# EAGLE design tongueboard (EAGLE 6.4)
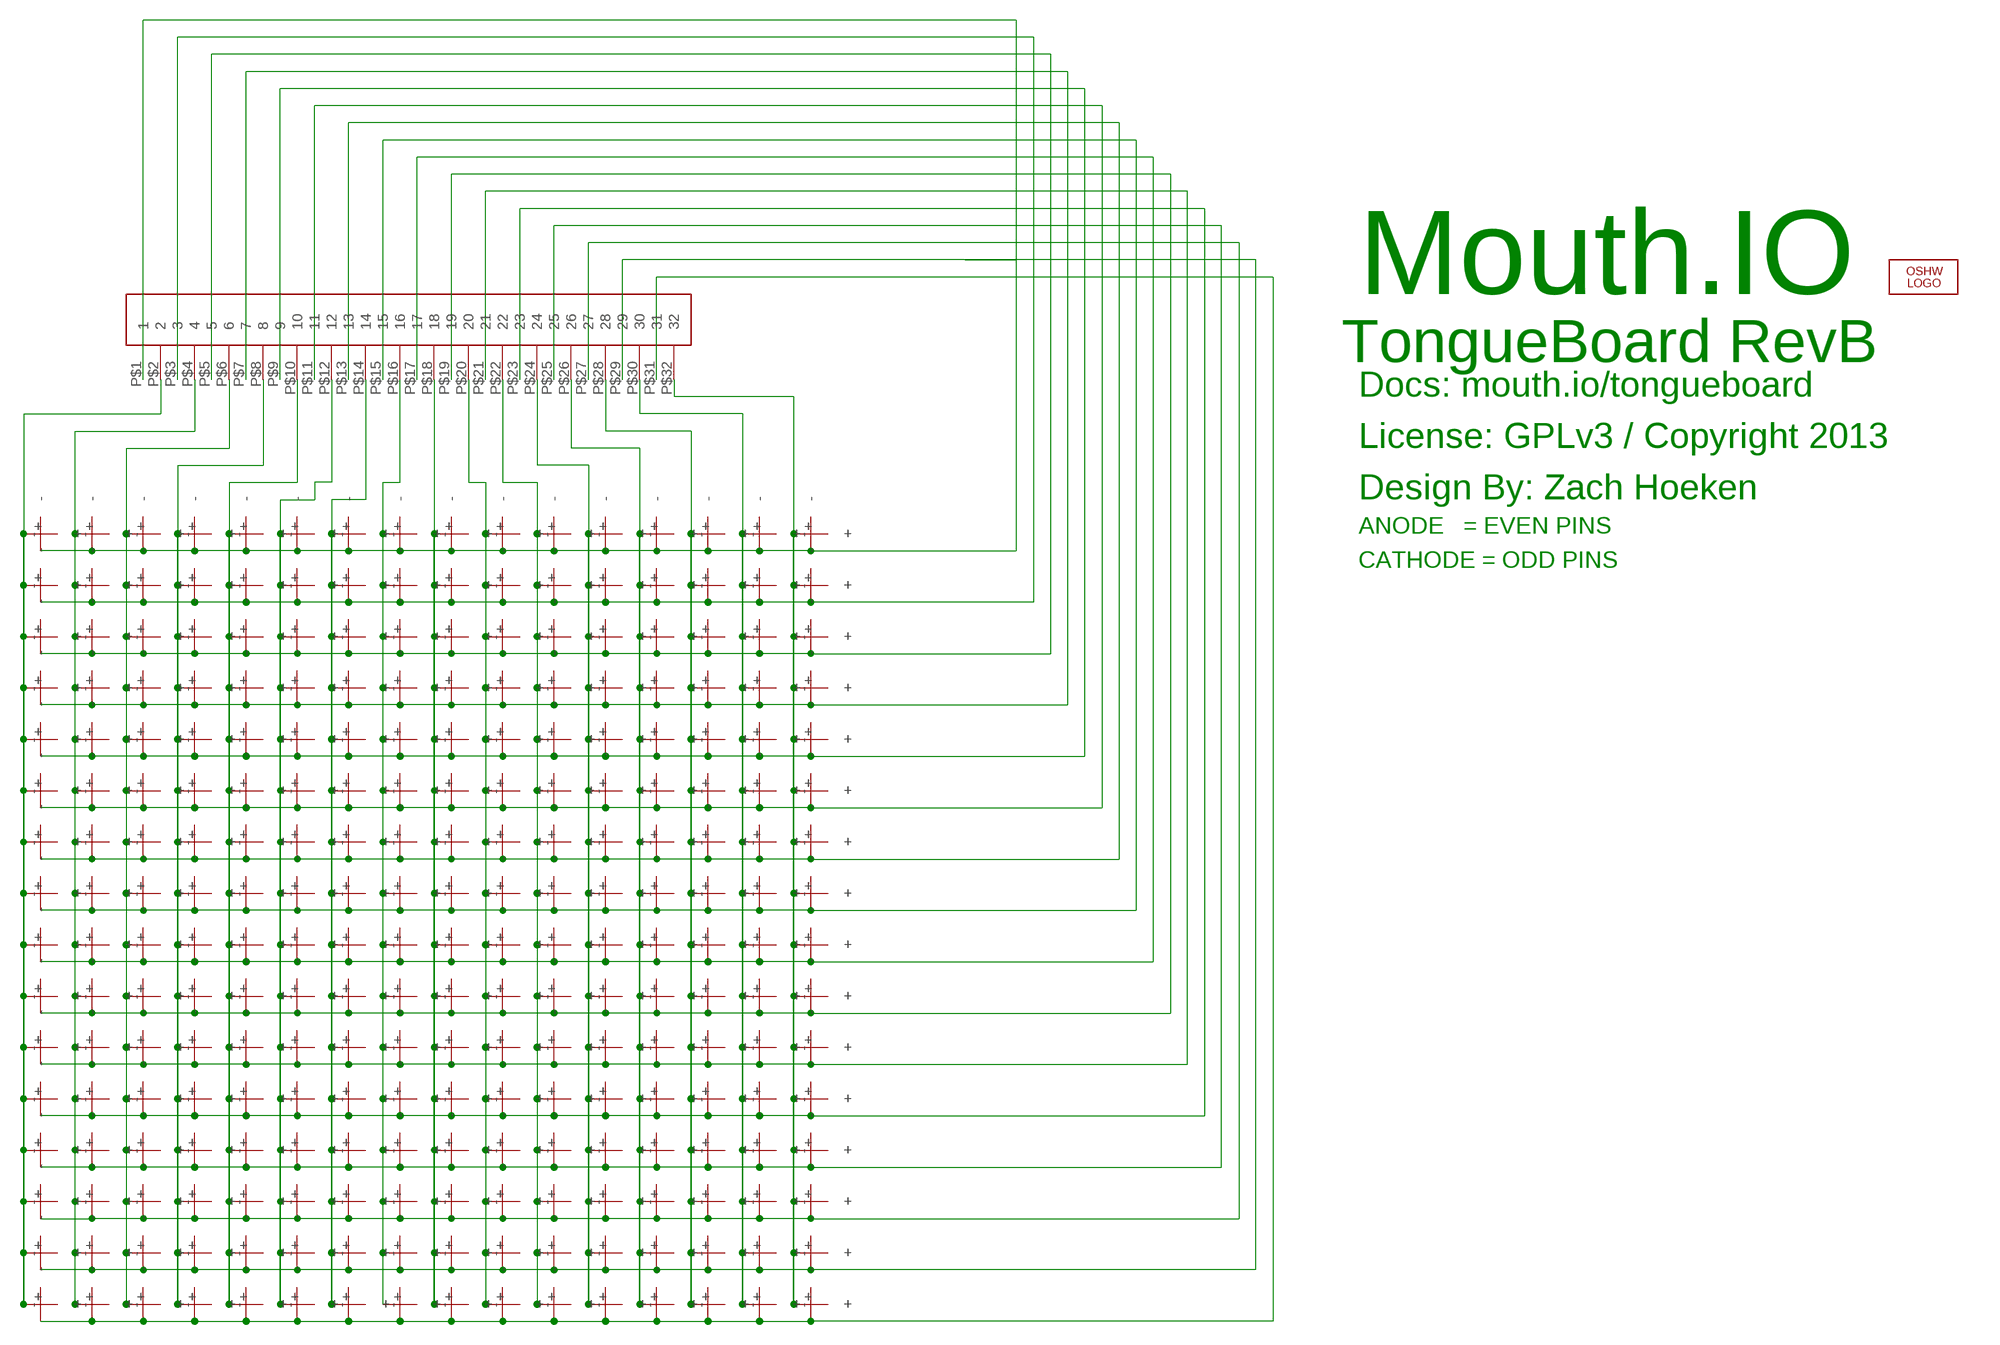
[diagram p0: schematic, sheet 1]

## Parts
LOGO1  OSHW_LOGO_10MIL  [OSHW_10X500_NOTEXT_COPPER]
U$1  ELECTRODE60MIL  [61MIL]
U$2  ELECTRODE60MIL  [61MIL]
U$3  ELECTRODE60MIL  [61MIL]
U$4  ELECTRODE60MIL  [61MIL]
U$5  ELECTRODE60MIL  [61MIL]
U$6  ELECTRODE60MIL  [61MIL]
U$7  ELECTRODE60MIL  [61MIL]
U$8  ELECTRODE60MIL  [61MIL]
U$9  ELECTRODE60MIL  [61MIL]
U$10  ELECTRODE60MIL  [61MIL]
U$11  ELECTRODE60MIL  [61MIL]
U$12  ELECTRODE60MIL  [61MIL]
U$13  ELECTRODE60MIL  [61MIL]
U$14  ELECTRODE60MIL  [61MIL]
U$15  ELECTRODE60MIL  [61MIL]
U$16  ELECTRODE61MILJCT  [61MILJCT]
U$17  ELECTRODE60MIL  [61MIL]
U$18  ELECTRODE60MIL  [61MIL]
U$19  ELECTRODE60MIL  [61MIL]
U$20  ELECTRODE60MIL  [61MIL]
U$21  ELECTRODE60MIL  [61MIL]
U$22  ELECTRODE60MIL  [61MIL]
U$23  ELECTRODE60MIL  [61MIL]
U$24  ELECTRODE60MIL  [61MIL]
U$25  ELECTRODE60MIL  [61MIL]
U$26  ELECTRODE60MIL  [61MIL]
U$27  ELECTRODE60MIL  [61MIL]
U$28  ELECTRODE60MIL  [61MIL]
U$29  ELECTRODE60MIL  [61MIL]
U$30  ELECTRODE60MIL  [61MIL]
U$31  ELECTRODE61MILJCT  [61MILJCT]
U$32  ELECTRODE60MIL  [61MIL]
U$33  ELECTRODE60MIL  [61MIL]
U$34  ELECTRODE60MIL  [61MIL]
U$35  ELECTRODE60MIL  [61MIL]
U$36  ELECTRODE60MIL  [61MIL]
U$37  ELECTRODE60MIL  [61MIL]
U$38  ELECTRODE60MIL  [61MIL]
U$39  ELECTRODE60MIL  [61MIL]
U$40  ELECTRODE60MIL  [61MIL]
U$41  ELECTRODE60MIL  [61MIL]
U$42  ELECTRODE60MIL  [61MIL]
U$43  ELECTRODE60MIL  [61MIL]
U$44  ELECTRODE60MIL  [61MIL]
U$45  ELECTRODE60MIL  [61MIL]
U$46  ELECTRODE61MILJCT  [61MILJCT]
U$47  ELECTRODE60MIL  [61MIL]
U$48  ELECTRODE60MIL  [61MIL]
U$49  ELECTRODE60MIL  [61MIL]
U$50  ELECTRODE60MIL  [61MIL]
U$51  ELECTRODE60MIL  [61MIL]
U$52  ELECTRODE60MIL  [61MIL]
U$53  ELECTRODE60MIL  [61MIL]
U$54  ELECTRODE60MIL  [61MIL]
U$55  ELECTRODE60MIL  [61MIL]
U$56  ELECTRODE60MIL  [61MIL]
U$57  ELECTRODE60MIL  [61MIL]
U$58  ELECTRODE60MIL  [61MIL]
U$59  ELECTRODE60MIL  [61MIL]
U$60  ELECTRODE60MIL  [61MIL]
U$61  ELECTRODE61MILJCT  [61MILJCT]
U$62  ELECTRODE60MIL  [61MIL]
U$63  ELECTRODE60MIL  [61MIL]
U$64  ELECTRODE60MIL  [61MIL]
U$65  ELECTRODE60MIL  [61MIL]
U$66  ELECTRODE60MIL  [61MIL]
U$67  ELECTRODE60MIL  [61MIL]
U$68  ELECTRODE60MIL  [61MIL]
U$69  ELECTRODE60MIL  [61MIL]
U$70  ELECTRODE60MIL  [61MIL]
U$71  ELECTRODE60MIL  [61MIL]
U$72  ELECTRODE60MIL  [61MIL]
U$73  ELECTRODE60MIL  [61MIL]
U$74  ELECTRODE60MIL  [61MIL]
U$75  ELECTRODE60MIL  [61MIL]
U$76  ELECTRODE61MILJCT  [61MILJCT]
U$77  ELECTRODE60MIL  [61MIL]
U$78  ELECTRODE60MIL  [61MIL]
U$79  ELECTRODE60MIL  [61MIL]
U$80  ELECTRODE60MIL  [61MIL]
U$81  ELECTRODE60MIL  [61MIL]
U$82  ELECTRODE60MIL  [61MIL]
U$83  ELECTRODE60MIL  [61MIL]
U$84  ELECTRODE60MIL  [61MIL]
U$85  ELECTRODE60MIL  [61MIL]
U$86  ELECTRODE60MIL  [61MIL]
U$87  ELECTRODE60MIL  [61MIL]
U$88  ELECTRODE60MIL  [61MIL]
U$89  ELECTRODE60MIL  [61MIL]
U$90  ELECTRODE60MIL  [61MIL]
U$91  ELECTRODE61MILJCT  [61MILJCT]
U$92  ELECTRODE60MIL  [61MIL]
U$93  ELECTRODE60MIL  [61MIL]
U$94  ELECTRODE60MIL  [61MIL]
U$95  ELECTRODE60MIL  [61MIL]
U$96  ELECTRODE60MIL  [61MIL]
U$97  ELECTRODE60MIL  [61MIL]
U$98  ELECTRODE60MIL  [61MIL]
U$99  ELECTRODE60MIL  [61MIL]
U$100  ELECTRODE60MIL  [61MIL]
U$101  ELECTRODE60MIL  [61MIL]
U$102  ELECTRODE60MIL  [61MIL]
U$103  ELECTRODE60MIL  [61MIL]
U$104  ELECTRODE60MIL  [61MIL]
U$105  ELECTRODE60MIL  [61MIL]
U$106  ELECTRODE61MILJCT  [61MILJCT]
U$107  ELECTRODE60MIL  [61MIL]
U$108  ELECTRODE60MIL  [61MIL]
U$109  ELECTRODE60MIL  [61MIL]
U$110  ELECTRODE60MIL  [61MIL]
U$111  ELECTRODE60MIL  [61MIL]
U$112  ELECTRODE60MIL  [61MIL]
U$113  ELECTRODE60MIL  [61MIL]
U$114  ELECTRODE60MIL  [61MIL]
U$115  ELECTRODE60MIL  [61MIL]
U$116  ELECTRODE60MIL  [61MIL]
U$117  ELECTRODE60MIL  [61MIL]
U$118  ELECTRODE60MIL  [61MIL]
U$119  ELECTRODE60MIL  [61MIL]
U$120  ELECTRODE60MIL  [61MIL]
U$121  ELECTRODE61MILJCT  [61MILJCT]
U$122  ELECTRODE60MIL  [61MIL]
U$123  ELECTRODE60MIL  [61MIL]
U$124  ELECTRODE60MIL  [61MIL]
U$125  ELECTRODE60MIL  [61MIL]
U$126  ELECTRODE60MIL  [61MIL]
U$127  ELECTRODE60MIL  [61MIL]
U$128  ELECTRODE60MIL  [61MIL]
U$129  ELECTRODE60MIL  [61MIL]
U$130  ELECTRODE60MIL  [61MIL]
U$131  ELECTRODE60MIL  [61MIL]
U$132  ELECTRODE60MIL  [61MIL]
U$133  ELECTRODE60MIL  [61MIL]
U$134  ELECTRODE60MIL  [61MIL]
U$135  ELECTRODE60MIL  [61MIL]
U$136  ELECTRODE61MILJCT  [61MILJCT]
U$137  ELECTRODE60MIL  [61MIL]
U$138  ELECTRODE60MIL  [61MIL]
U$139  ELECTRODE60MIL  [61MIL]
U$140  ELECTRODE60MIL  [61MIL]
U$141  ELECTRODE60MIL  [61MIL]
U$142  ELECTRODE60MIL  [61MIL]
U$143  ELECTRODE60MIL  [61MIL]
U$144  ELECTRODE60MIL  [61MIL]
U$145  ELECTRODE60MIL  [61MIL]
U$146  ELECTRODE60MIL  [61MIL]
U$147  ELECTRODE60MIL  [61MIL]
U$148  ELECTRODE60MIL  [61MIL]
U$149  ELECTRODE60MIL  [61MIL]
U$150  ELECTRODE60MIL  [61MIL]
U$151  ELECTRODE61MILJCT  [61MILJCT]
U$152  ELECTRODE60MIL  [61MIL]
U$153  ELECTRODE60MIL  [61MIL]
U$154  ELECTRODE60MIL  [61MIL]
U$155  ELECTRODE60MIL  [61MIL]
U$156  ELECTRODE60MIL  [61MIL]
U$157  ELECTRODE60MIL  [61MIL]
U$158  ELECTRODE60MIL  [61MIL]
U$159  ELECTRODE60MIL  [61MIL]
U$160  ELECTRODE60MIL  [61MIL]
U$161  ELECTRODE60MIL  [61MIL]
U$162  ELECTRODE60MIL  [61MIL]
U$163  ELECTRODE60MIL  [61MIL]
U$164  ELECTRODE60MIL  [61MIL]
U$165  ELECTRODE60MIL  [61MIL]
U$166  ELECTRODE61MILJCT  [61MILJCT]
U$167  ELECTRODE60MIL  [61MIL]
U$168  ELECTRODE60MIL  [61MIL]
U$169  ELECTRODE60MIL  [61MIL]
U$170  ELECTRODE60MIL  [61MIL]
U$171  ELECTRODE60MIL  [61MIL]
U$172  ELECTRODE60MIL  [61MIL]
U$173  ELECTRODE60MIL  [61MIL]
U$174  ELECTRODE60MIL  [61MIL]
U$175  ELECTRODE60MIL  [61MIL]
U$176  ELECTRODE60MIL  [61MIL]
U$177  ELECTRODE60MIL  [61MIL]
U$178  ELECTRODE60MIL  [61MIL]
U$179  ELECTRODE60MIL  [61MIL]
U$180  ELECTRODE60MIL  [61MIL]
U$181  ELECTRODE61MILJCT  [61MILJCT]
U$182  ELECTRODE60MIL  [61MIL]
U$183  ELECTRODE60MIL  [61MIL]
U$184  ELECTRODE60MIL  [61MIL]
U$185  ELECTRODE60MIL  [61MIL]
U$186  ELECTRODE60MIL  [61MIL]
U$187  ELECTRODE60MIL  [61MIL]
U$188  ELECTRODE60MIL  [61MIL]
U$189  ELECTRODE60MIL  [61MIL]
U$190  ELECTRODE60MIL  [61MIL]
U$191  ELECTRODE60MIL  [61MIL]
U$192  ELECTRODE60MIL  [61MIL]
U$193  ELECTRODE60MIL  [61MIL]
U$194  ELECTRODE60MIL  [61MIL]
U$195  ELECTRODE60MIL  [61MIL]
U$196  ELECTRODE61MILJCT  [61MILJCT]
U$197  ELECTRODE60MIL  [61MIL]
U$198  ELECTRODE60MIL  [61MIL]
U$199  ELECTRODE60MIL  [61MIL]
U$200  ELECTRODE60MIL  [61MIL]
U$201  ELECTRODE60MIL  [61MIL]
U$202  ELECTRODE60MIL  [61MIL]
U$203  ELECTRODE60MIL  [61MIL]
U$204  ELECTRODE60MIL  [61MIL]
U$205  ELECTRODE60MIL  [61MIL]
U$206  ELECTRODE60MIL  [61MIL]
U$207  ELECTRODE60MIL  [61MIL]
U$208  ELECTRODE60MIL  [61MIL]
U$209  ELECTRODE60MIL  [61MIL]
U$210  ELECTRODE60MIL  [61MIL]
U$211  ELECTRODE61MILJCT  [61MILJCT]
U$212  ELECTRODE60MIL  [61MIL]
U$213  ELECTRODE60MIL  [61MIL]
U$214  ELECTRODE60MIL  [61MIL]
U$215  ELECTRODE60MIL  [61MIL]
U$216  ELECTRODE60MIL  [61MIL]
U$217  ELECTRODE60MIL  [61MIL]
U$218  ELECTRODE60MIL  [61MIL]
U$219  ELECTRODE60MIL  [61MIL]
U$220  ELECTRODE60MIL  [61MIL]
U$221  ELECTRODE60MIL  [61MIL]
U$222  ELECTRODE60MIL  [61MIL]
U$223  ELECTRODE60MIL  [61MIL]
U$224  ELECTRODE60MIL  [61MIL]
U$225  ELECTRODE60MIL  [61MIL]
U$226  ELECTRODE61MILJCT  [61MILJCT]
U$227  ELECTRODE60MIL  [61MIL]
U$228  ELECTRODE60MIL  [61MIL]
U$229  ELECTRODE60MIL  [61MIL]
U$230  ELECTRODE60MIL  [61MIL]
U$231  ELECTRODE60MIL  [61MIL]
U$232  ELECTRODE60MIL  [61MIL]
U$233  ELECTRODE60MIL  [61MIL]
U$234  ELECTRODE60MIL  [61MIL]
U$235  ELECTRODE60MIL  [61MIL]
U$236  ELECTRODE60MIL  [61MIL]
U$237  ELECTRODE60MIL  [61MIL]
U$238  ELECTRODE60MIL  [61MIL]
U$239  ELECTRODE60MIL  [61MIL]
U$240  ELECTRODE60MIL  [61MIL]
U$241  ELECTRODE61MILJCT  [61MILJCT]
U$242  ELECTRODE60MIL  [61MIL]
U$243  ELECTRODE60MIL  [61MIL]
U$244  ELECTRODE60MIL  [61MIL]
U$245  ELECTRODE60MIL  [61MIL]
U$246  ELECTRODE60MIL  [61MIL]
U$247  ELECTRODE60MIL  [61MIL]
U$248  ELECTRODE60MIL  [61MIL]
U$249  ELECTRODE60MIL  [61MIL]
U$250  ELECTRODE60MIL  [61MIL]
U$251  ELECTRODE60MIL  [61MIL]
U$252  ELECTRODE60MIL  [61MIL]
U$253  ELECTRODE60MIL  [61MIL]
U$254  ELECTRODE60MIL  [61MIL]
U$255  ELECTRODE60MIL  [61MIL]
U$256  ELECTRODE60MIL  [61MIL]
U$257  FPC-0.5-32  [FPC-32-WIRE]

## Nets
A0: U$1.+ U$17.+ U$33.+ U$49.+ U$65.+ U$81.+ U$97.+ U$113.+ U$129.+ U$145.+ U$161.+ U$177.+ U$193.+ U$209.+ U$225.+ U$241.+ U$257.P$2
A1: U$2.+ U$18.+ U$34.+ U$50.+ U$66.+ U$82.+ U$98.+ U$114.+ U$130.+ U$146.+ U$162.+ U$178.+ U$194.+ U$210.+ U$226.+ U$242.+ U$257.P$4
A2: U$3.+ U$19.+ U$35.+ U$51.+ U$67.+ U$83.+ U$99.+ U$115.+ U$131.+ U$147.+ U$163.+ U$179.+ U$195.+ U$211.+ U$227.+ U$243.+ U$257.P$6
A3: U$4.+ U$20.+ U$36.+ U$52.+ U$68.+ U$84.+ U$100.+ U$116.+ U$132.+ U$148.+ U$164.+ U$180.+ U$196.+ U$212.+ U$228.+ U$244.+ U$257.P$8
A4: U$5.+ U$21.+ U$37.+ U$53.+ U$69.+ U$85.+ U$101.+ U$117.+ U$133.+ U$149.+ U$165.+ U$181.+ U$197.+ U$213.+ U$229.+ U$245.+ U$257.P$10
A5: U$6.+ U$22.+ U$38.+ U$54.+ U$70.+ U$86.+ U$102.+ U$118.+ U$134.+ U$150.+ U$166.+ U$182.+ U$198.+ U$214.+ U$230.+ U$246.+ U$257.P$12
A6: U$7.+ U$23.+ U$39.+ U$55.+ U$71.+ U$87.+ U$103.+ U$119.+ U$135.+ U$151.+ U$167.+ U$183.+ U$199.+ U$215.+ U$231.+ U$247.+ U$257.P$14
A7: U$8.+ U$24.+ U$40.+ U$56.+ U$72.+ U$88.+ U$104.+ U$120.+ U$136.+ U$152.+ U$168.+ U$184.+ U$200.+ U$216.+ U$232.+ U$248.+ U$257.P$16
A8: U$9.+ U$25.+ U$41.+ U$57.+ U$73.+ U$89.+ U$105.+ U$121.+ U$137.+ U$153.+ U$169.+ U$185.+ U$201.+ U$217.+ U$233.+ U$249.+ U$257.P$18
A9: U$10.+ U$26.+ U$42.+ U$58.+ U$74.+ U$90.+ U$106.+ U$122.+ U$138.+ U$154.+ U$170.+ U$186.+ U$202.+ U$218.+ U$234.+ U$250.+ U$257.P$20
A10: U$11.+ U$27.+ U$43.+ U$59.+ U$75.+ U$91.+ U$107.+ U$123.+ U$139.+ U$155.+ U$171.+ U$187.+ U$203.+ U$219.+ U$235.+ U$251.+ U$257.P$22
A11: U$12.+ U$28.+ U$44.+ U$60.+ U$76.+ U$92.+ U$108.+ U$124.+ U$140.+ U$156.+ U$172.+ U$188.+ U$204.+ U$220.+ U$236.+ U$252.+ U$257.P$24
A12: U$13.+ U$29.+ U$45.+ U$61.+ U$77.+ U$93.+ U$109.+ U$125.+ U$141.+ U$157.+ U$173.+ U$189.+ U$205.+ U$221.+ U$237.+ U$253.+ U$257.P$26
A13: U$14.+ U$30.+ U$46.+ U$62.+ U$78.+ U$94.+ U$110.+ U$126.+ U$142.+ U$158.+ U$174.+ U$190.+ U$206.+ U$222.+ U$238.+ U$254.+ U$257.P$28
A14: U$15.+ U$31.+ U$47.+ U$63.+ U$79.+ U$95.+ U$111.+ U$127.+ U$143.+ U$159.+ U$175.+ U$191.+ U$207.+ U$223.+ U$239.+ U$255.+ U$257.P$30
A15: U$16.+ U$32.+ U$48.+ U$64.+ U$80.+ U$96.+ U$112.+ U$128.+ U$144.+ U$160.+ U$176.+ U$192.+ U$208.+ U$224.+ U$240.+ U$256.+ U$257.P$32
C0: U$241.- U$242.- U$243.- U$244.- U$245.- U$246.- U$247.- U$248.- U$249.- U$250.- U$251.- U$252.- U$253.- U$254.- U$255.- U$256.- U$257.P$1
C1: U$225.- U$226.- U$227.- U$228.- U$229.- U$230.- U$231.- U$232.- U$233.- U$234.- U$235.- U$236.- U$237.- U$238.- U$239.- U$240.- U$257.P$3
C2: U$209.- U$210.- U$211.- U$212.- U$213.- U$214.- U$215.- U$216.- U$217.- U$218.- U$219.- U$220.- U$221.- U$222.- U$223.- U$224.- U$257.P$5
C3: U$193.- U$194.- U$195.- U$196.- U$197.- U$198.- U$199.- U$200.- U$201.- U$202.- U$203.- U$204.- U$205.- U$206.- U$207.- U$208.- U$257.P$7
C4: U$177.- U$178.- U$179.- U$180.- U$181.- U$182.- U$183.- U$184.- U$185.- U$186.- U$187.- U$188.- U$189.- U$190.- U$191.- U$192.- U$257.P$9
C5: U$161.- U$162.- U$163.- U$164.- U$165.- U$166.- U$167.- U$168.- U$169.- U$170.- U$171.- U$172.- U$173.- U$174.- U$175.- U$176.- U$257.P$11
C6: U$145.- U$146.- U$147.- U$148.- U$149.- U$150.- U$151.- U$152.- U$153.- U$154.- U$155.- U$156.- U$157.- U$158.- U$159.- U$160.- U$257.P$13
C7: U$129.- U$130.- U$131.- U$132.- U$133.- U$134.- U$135.- U$136.- U$137.- U$138.- U$139.- U$140.- U$141.- U$142.- U$143.- U$144.- U$257.P$15
C8: U$113.- U$114.- U$115.- U$116.- U$117.- U$118.- U$119.- U$120.- U$121.- U$122.- U$123.- U$124.- U$125.- U$126.- U$127.- U$128.- U$257.P$17
C9: U$97.- U$98.- U$99.- U$100.- U$101.- U$102.- U$103.- U$104.- U$105.- U$106.- U$107.- U$108.- U$109.- U$110.- U$111.- U$112.- U$257.P$19
C10: U$81.- U$82.- U$83.- U$84.- U$85.- U$86.- U$87.- U$88.- U$89.- U$90.- U$91.- U$92.- U$93.- U$94.- U$95.- U$96.- U$257.P$21
C11: U$65.- U$66.- U$67.- U$68.- U$69.- U$70.- U$71.- U$72.- U$73.- U$74.- U$75.- U$76.- U$77.- U$78.- U$79.- U$80.- U$257.P$23
C12: U$49.- U$50.- U$51.- U$52.- U$53.- U$54.- U$55.- U$56.- U$57.- U$58.- U$59.- U$60.- U$61.- U$62.- U$63.- U$64.- U$257.P$25
C13: U$33.- U$34.- U$35.- U$36.- U$37.- U$38.- U$39.- U$40.- U$41.- U$42.- U$43.- U$44.- U$45.- U$46.- U$47.- U$48.- U$257.P$27
C14: U$17.- U$18.- U$19.- U$20.- U$21.- U$22.- U$23.- U$24.- U$25.- U$26.- U$27.- U$28.- U$29.- U$30.- U$31.- U$32.- U$257.P$29
C15: U$1.- U$2.- U$3.- U$4.- U$5.- U$6.- U$7.- U$8.- U$9.- U$10.- U$11.- U$12.- U$13.- U$14.- U$15.- U$16.- U$257.P$31

## Notes on the sheet
- Mouth.IO
- TongueBoard RevB
- Docs: mouth.io/tongueboard
- License: GPLv3 / Copyright 2013
- Design By: Zach Hoeken
- ANODE   = EVEN PINS
- CATHODE = ODD PINS

## Library data of the parts
LOGO1 = ohw-logo:OSHW_LOGO_10MIL
U$1-U$256 = Hoeken:ELECTRODE
U$257 = Hoektronics:FPC-0.5-32

## Net classes
0 default: width 0.178 mm, clearance 0.178 mm

## Board
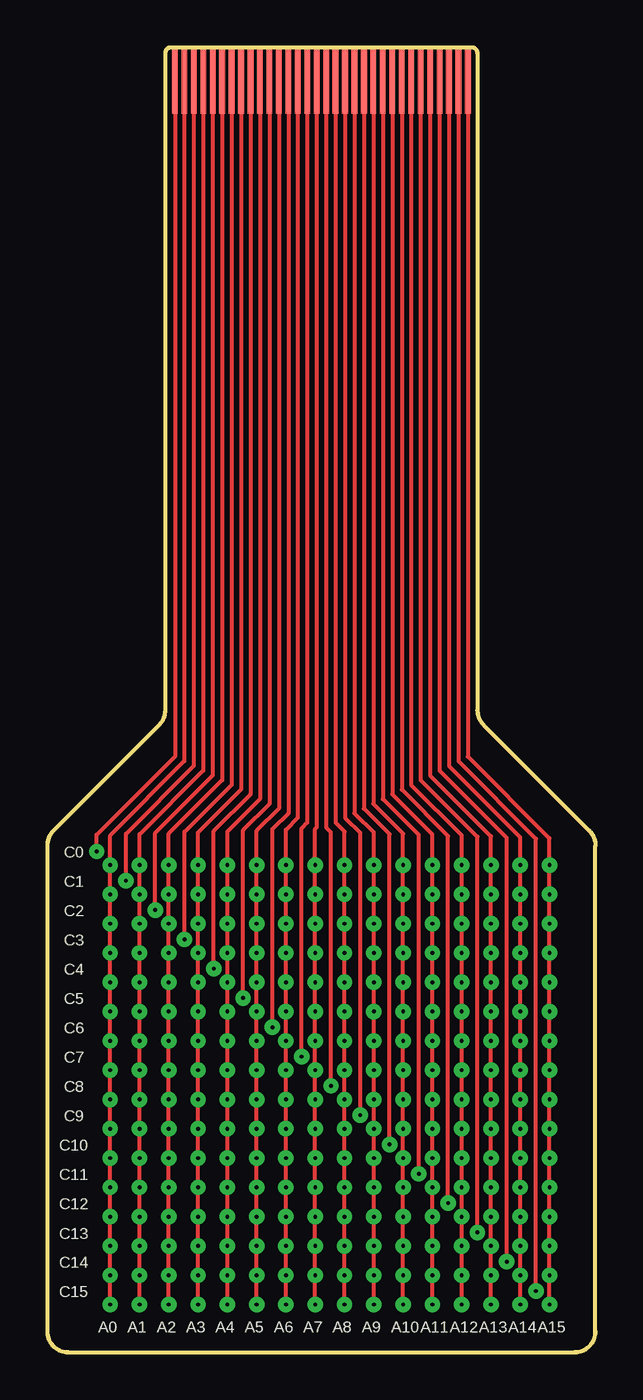
[diagram p1: board, top side]
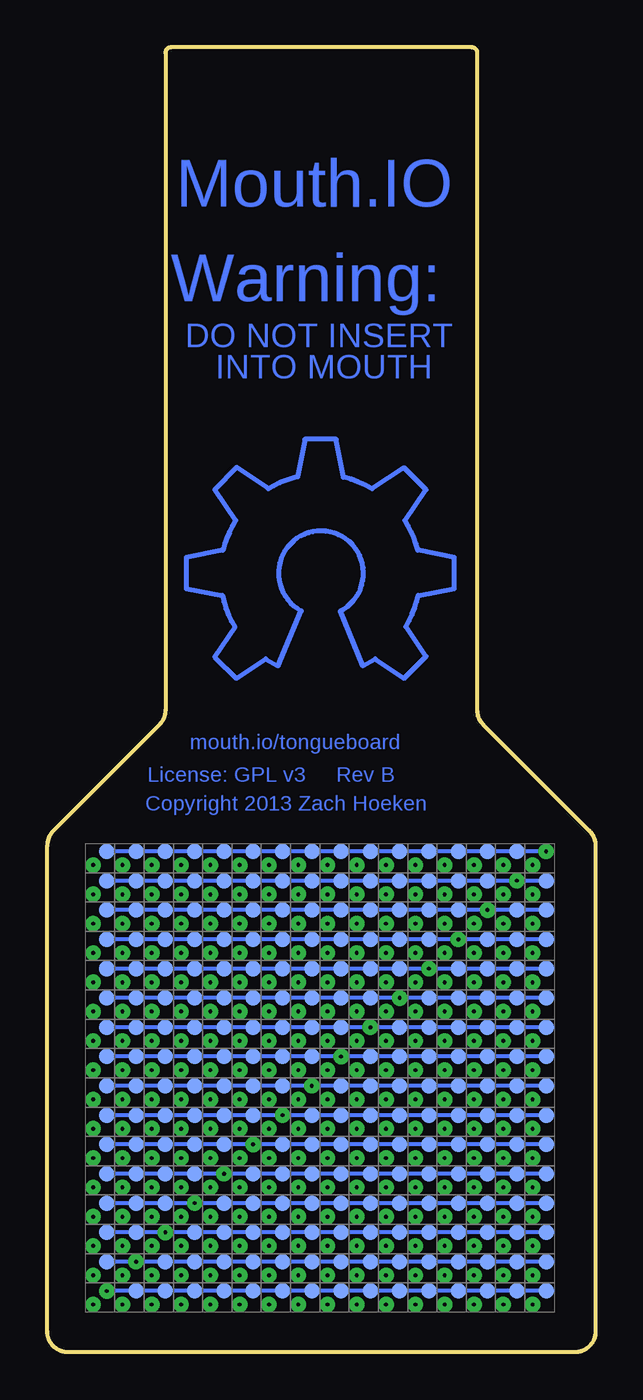
[diagram p2: board, bottom side, seen from below]

Size 29 x 69 mm. Coordinates in mm from the lower left corner, seen from the top.
Outline: 0.32,27.57 5.93,33.18 arc45 6.25,33.96 6.25,68.7 arc-90 6.55,69 22.45,69 arc-90 22.75,68.7 22.75,33.96 arc45 23.07,33.18 28.68,27.57 arc-45 29,26.79 29,1.1 arc-90 27.9,0 1.1,0 arc-90 0,1.1 0,26.79 arc-45 0.32,27.57
Copper layers (1*16): Top 0.035mm / dielectric 1.5mm / Bottom 0.035mm
Design rules "flex-circuits *": minimum track width 10mil, minimum drill 24mil, track to track 8mil, track to pad 8mil, pad to pad 8mil, via to via 8mil, smd to smd 8mil, copper to edge 40mil, drill to drill 8mil, minimum pad ring 10mil, minimum via ring 8mil, stop-mask expansion 4mil, vias tented up to drill 10mil, thermal gap 10mil

### Footprints (pad centres in the part's own frame; a part is rotated, then mirrored left to right if it is on the bottom)
61MIL = drill 0.203 pad 0.813: + 0,0 | smd 0.813 x 0.813 rotated 135: - 0.718,0.718
61MILJCT = drill 0.203 pad 0.813: + 0,0; - 0.718,0.718
FPC-32-WIRE = smd 0.3 x 3.5: P$1 -7.75,0; P$2 -7.25,0; P$3 -6.75,0; P$4 -6.25,0; P$5 -5.75,0; P$6 -5.25,0; P$7 -4.75,0; P$8 -4.25,0; P$9 -3.75,0; P$10 -3.25,0; P$11 -2.75,0; P$12 -2.25,0; P$13 -1.75,0; P$14 -1.25,0; P$15 -0.75,0; P$16 -0.25,0; P$17 0.25,0; P$18 0.75,0; P$19 1.25,0; P$20 1.75,0; P$21 2.25,0; P$22 2.75,0; P$23 3.25,0; P$24 3.75,0; P$25 4.25,0; P$26 4.75,0; P$27 5.25,0; P$28 5.75,0; P$29 6.25,0; P$30 6.75,0; P$31 7.25,0; P$32 7.75,0

### Placement (x,y rotation side)
LOGO1  7.47,35.6 0 top
U$1  3.33,2.52 0 bottom
U$2  4.88,2.52 0 bottom
U$3  6.43,2.52 0 bottom
U$4  7.98,2.52 0 bottom
U$5  9.53,2.52 0 bottom
U$6  11.08,2.52 0 bottom
U$7  12.63,2.52 0 bottom
U$8  14.18,2.52 0 bottom
U$9  15.72,2.52 0 bottom
U$10  17.27,2.52 0 bottom
U$11  18.82,2.52 0 bottom
U$12  20.37,2.52 0 bottom
U$13  21.92,2.52 0 bottom
U$14  23.47,2.52 0 bottom
U$15  25.02,2.52 0 bottom
U$16  26.57,2.52 0 bottom
U$17  3.33,4.07 0 bottom
U$18  4.88,4.07 0 bottom
U$19  6.43,4.07 0 bottom
U$20  7.98,4.07 0 bottom
U$21  9.53,4.07 0 bottom
U$22  11.08,4.07 0 bottom
U$23  12.63,4.07 0 bottom
U$24  14.18,4.07 0 bottom
U$25  15.72,4.07 0 bottom
U$26  17.27,4.07 0 bottom
U$27  18.82,4.07 0 bottom
U$28  20.37,4.07 0 bottom
U$29  21.92,4.07 0 bottom
U$30  23.47,4.07 0 bottom
U$31  25.02,4.07 0 bottom
U$32  26.57,4.07 0 bottom
U$33  3.33,5.62 0 bottom
U$34  4.88,5.62 0 bottom
U$35  6.43,5.62 0 bottom
U$36  7.98,5.62 0 bottom
U$37  9.53,5.62 0 bottom
U$38  11.08,5.62 0 bottom
U$39  12.63,5.62 0 bottom
U$40  14.18,5.62 0 bottom
U$41  15.72,5.62 0 bottom
U$42  17.27,5.62 0 bottom
U$43  18.82,5.62 0 bottom
U$44  20.37,5.62 0 bottom
U$45  21.92,5.62 0 bottom
U$46  23.47,5.62 0 bottom
U$47  25.02,5.62 0 bottom
U$48  26.57,5.62 0 bottom
U$49  3.33,7.17 0 bottom
U$50  4.88,7.17 0 bottom
U$51  6.43,7.17 0 bottom
U$52  7.98,7.17 0 bottom
U$53  9.53,7.17 0 bottom
U$54  11.08,7.17 0 bottom
U$55  12.63,7.17 0 bottom
U$56  14.18,7.17 0 bottom
U$57  15.72,7.17 0 bottom
U$58  17.27,7.17 0 bottom
U$59  18.82,7.17 0 bottom
U$60  20.37,7.17 0 bottom
U$61  21.92,7.17 0 bottom
U$62  23.47,7.17 0 bottom
U$63  25.02,7.17 0 bottom
U$64  26.57,7.17 0 bottom
U$65  3.33,8.72 0 bottom
U$66  4.88,8.72 0 bottom
U$67  6.43,8.72 0 bottom
U$68  7.98,8.72 0 bottom
U$69  9.53,8.72 0 bottom
U$70  11.08,8.72 0 bottom
U$71  12.63,8.72 0 bottom
U$72  14.18,8.72 0 bottom
U$73  15.72,8.72 0 bottom
U$74  17.27,8.72 0 bottom
U$75  18.82,8.72 0 bottom
U$76  20.37,8.72 0 bottom
U$77  21.92,8.72 0 bottom
U$78  23.47,8.72 0 bottom
U$79  25.02,8.72 0 bottom
U$80  26.57,8.72 0 bottom
U$81  3.33,10.27 0 bottom
U$82  4.88,10.27 0 bottom
U$83  6.43,10.27 0 bottom
U$84  7.98,10.27 0 bottom
U$85  9.53,10.27 0 bottom
U$86  11.08,10.27 0 bottom
U$87  12.63,10.27 0 bottom
U$88  14.18,10.27 0 bottom
U$89  15.72,10.27 0 bottom
U$90  17.27,10.27 0 bottom
U$91  18.82,10.27 0 bottom
U$92  20.37,10.27 0 bottom
U$93  21.92,10.27 0 bottom
U$94  23.47,10.27 0 bottom
U$95  25.02,10.27 0 bottom
U$96  26.57,10.27 0 bottom
U$97  3.33,11.82 0 bottom
U$98  4.88,11.82 0 bottom
U$99  6.43,11.82 0 bottom
U$100  7.98,11.82 0 bottom
U$101  9.53,11.82 0 bottom
U$102  11.08,11.82 0 bottom
U$103  12.63,11.82 0 bottom
U$104  14.18,11.82 0 bottom
U$105  15.72,11.82 0 bottom
U$106  17.27,11.82 0 bottom
U$107  18.82,11.82 0 bottom
U$108  20.37,11.82 0 bottom
U$109  21.92,11.82 0 bottom
U$110  23.47,11.82 0 bottom
U$111  25.02,11.82 0 bottom
U$112  26.57,11.82 0 bottom
U$113  3.33,13.37 0 bottom
U$114  4.88,13.37 0 bottom
U$115  6.43,13.37 0 bottom
U$116  7.98,13.37 0 bottom
U$117  9.53,13.37 0 bottom
U$118  11.08,13.37 0 bottom
U$119  12.63,13.37 0 bottom
U$120  14.18,13.37 0 bottom
U$121  15.72,13.37 0 bottom
U$122  17.27,13.37 0 bottom
U$123  18.82,13.37 0 bottom
U$124  20.37,13.37 0 bottom
U$125  21.92,13.37 0 bottom
U$126  23.47,13.37 0 bottom
U$127  25.02,13.37 0 bottom
U$128  26.57,13.37 0 bottom
U$129  3.33,14.91 0 bottom
U$130  4.88,14.91 0 bottom
U$131  6.43,14.91 0 bottom
U$132  7.98,14.91 0 bottom
U$133  9.53,14.91 0 bottom
U$134  11.08,14.91 0 bottom
U$135  12.63,14.91 0 bottom
U$136  14.18,14.91 0 bottom
U$137  15.72,14.91 0 bottom
U$138  17.27,14.91 0 bottom
U$139  18.82,14.91 0 bottom
U$140  20.37,14.91 0 bottom
U$141  21.92,14.91 0 bottom
U$142  23.47,14.91 0 bottom
U$143  25.02,14.91 0 bottom
U$144  26.57,14.91 0 bottom
U$145  3.33,16.46 0 bottom
U$146  4.88,16.46 0 bottom
U$147  6.43,16.46 0 bottom
U$148  7.98,16.46 0 bottom
U$149  9.53,16.46 0 bottom
U$150  11.08,16.46 0 bottom
U$151  12.63,16.46 0 bottom
U$152  14.18,16.46 0 bottom
U$153  15.72,16.46 0 bottom
U$154  17.27,16.46 0 bottom
U$155  18.82,16.46 0 bottom
U$156  20.37,16.46 0 bottom
U$157  21.92,16.46 0 bottom
U$158  23.47,16.46 0 bottom
U$159  25.02,16.46 0 bottom
U$160  26.57,16.46 0 bottom
U$161  3.33,18.01 0 bottom
U$162  4.88,18.01 0 bottom
U$163  6.43,18.01 0 bottom
U$164  7.98,18.01 0 bottom
U$165  9.53,18.01 0 bottom
U$166  11.08,18.01 0 bottom
U$167  12.63,18.01 0 bottom
U$168  14.18,18.01 0 bottom
U$169  15.72,18.01 0 bottom
U$170  17.27,18.01 0 bottom
U$171  18.82,18.01 0 bottom
U$172  20.37,18.01 0 bottom
U$173  21.92,18.01 0 bottom
U$174  23.47,18.01 0 bottom
U$175  25.02,18.01 0 bottom
U$176  26.57,18.01 0 bottom
U$177  3.33,19.56 0 bottom
U$178  4.88,19.56 0 bottom
U$179  6.43,19.56 0 bottom
U$180  7.98,19.56 0 bottom
U$181  9.53,19.56 0 bottom
U$182  11.08,19.56 0 bottom
U$183  12.63,19.56 0 bottom
U$184  14.18,19.56 0 bottom
U$185  15.72,19.56 0 bottom
U$186  17.27,19.56 0 bottom
U$187  18.82,19.56 0 bottom
U$188  20.37,19.56 0 bottom
U$189  21.92,19.56 0 bottom
U$190  23.47,19.56 0 bottom
U$191  25.02,19.56 0 bottom
U$192  26.57,19.56 0 bottom
U$193  3.33,21.11 0 bottom
U$194  4.88,21.11 0 bottom
U$195  6.43,21.11 0 bottom
U$196  7.98,21.11 0 bottom
U$197  9.53,21.11 0 bottom
U$198  11.08,21.11 0 bottom
U$199  12.63,21.11 0 bottom
U$200  14.18,21.11 0 bottom
U$201  15.72,21.11 0 bottom
U$202  17.27,21.11 0 bottom
U$203  18.82,21.11 0 bottom
U$204  20.37,21.11 0 bottom
U$205  21.92,21.11 0 bottom
U$206  23.47,21.11 0 bottom
U$207  25.02,21.11 0 bottom
U$208  26.57,21.11 0 bottom
U$209  3.33,22.66 0 bottom
U$210  4.88,22.66 0 bottom
U$211  6.43,22.66 0 bottom
U$212  7.98,22.66 0 bottom
U$213  9.53,22.66 0 bottom
U$214  11.08,22.66 0 bottom
U$215  12.63,22.66 0 bottom
U$216  14.18,22.66 0 bottom
U$217  15.72,22.66 0 bottom
U$218  17.27,22.66 0 bottom
U$219  18.82,22.66 0 bottom
U$220  20.37,22.66 0 bottom
U$221  21.92,22.66 0 bottom
U$222  23.47,22.66 0 bottom
U$223  25.02,22.66 0 bottom
U$224  26.57,22.66 0 bottom
U$225  3.33,24.21 0 bottom
U$226  4.88,24.21 0 bottom
U$227  6.43,24.21 0 bottom
U$228  7.98,24.21 0 bottom
U$229  9.53,24.21 0 bottom
U$230  11.08,24.21 0 bottom
U$231  12.63,24.21 0 bottom
U$232  14.18,24.21 0 bottom
U$233  15.72,24.21 0 bottom
U$234  17.27,24.21 0 bottom
U$235  18.82,24.21 0 bottom
U$236  20.37,24.21 0 bottom
U$237  21.92,24.21 0 bottom
U$238  23.47,24.21 0 bottom
U$239  25.02,24.21 0 bottom
U$240  26.57,24.21 0 bottom
U$241  3.33,25.76 0 bottom
U$242  4.88,25.76 0 bottom
U$243  6.43,25.76 0 bottom
U$244  7.98,25.76 0 bottom
U$245  9.53,25.76 0 bottom
U$246  11.08,25.76 0 bottom
U$247  12.63,25.76 0 bottom
U$248  14.18,25.76 0 bottom
U$249  15.72,25.76 0 bottom
U$250  17.27,25.76 0 bottom
U$251  18.82,25.76 0 bottom
U$252  20.37,25.76 0 bottom
U$253  21.92,25.76 0 bottom
U$254  23.47,25.76 0 bottom
U$255  25.02,25.76 0 bottom
U$256  26.57,25.76 0 bottom
U$257  14.5,67.25 0 top

### Tracks (layer width: path | path; a pad name or v marks a point on that pad's centre or on a via)
A0
  Top 0.2: U$1.+ U$17.+ U$33.+ U$49.+ U$65.+ U$81.+ U$97.+ U$113.+ U$129.+ U$145.+ U$161.+ U$177.+ U$193.+ U$209.+ U$225.+ U$241.+ 3.33,27.33 7.25,31.25 U$257.P$2
A1
  Top 0.2: U$2.+ U$18.+ U$34.+ U$50.+ U$66.+ U$82.+ U$98.+ U$114.+ U$130.+ U$146.+ U$162.+ U$178.+ U$194.+ U$210.+ U$226.+ U$242.+ 4.88,27.38 8.25,30.75 U$257.P$4
A2
  Top 0.2: U$3.+ U$19.+ U$35.+ U$51.+ U$67.+ U$83.+ U$99.+ U$115.+ U$131.+ U$147.+ U$163.+ U$179.+ U$195.+ U$211.+ U$227.+ U$243.+ 6.43,27.43 9.25,30.25 U$257.P$6
A3
  Top 0.2: U$4.+ U$20.+ U$36.+ U$52.+ U$68.+ U$84.+ U$100.+ U$116.+ U$132.+ U$148.+ U$164.+ U$180.+ U$196.+ U$212.+ U$228.+ U$244.+ 7.98,27.48 10.25,29.75 U$257.P$8
A4
  Top 0.2: U$5.+ U$21.+ U$37.+ U$53.+ U$69.+ U$85.+ U$101.+ U$117.+ U$133.+ U$149.+ U$165.+ U$181.+ U$197.+ U$213.+ U$229.+ U$245.+ 9.53,27.53 11.25,29.25 U$257.P$10
A5
  Top 0.2: U$6.+ U$22.+ U$38.+ U$54.+ U$70.+ U$86.+ U$102.+ U$118.+ U$134.+ U$150.+ U$166.+ U$182.+ U$198.+ U$214.+ U$230.+ U$246.+ 11.08,27.58 12.25,28.75 U$257.P$12
A6
  Top 0.2: U$7.+ U$23.+ U$39.+ U$55.+ U$71.+ U$87.+ U$103.+ U$119.+ U$135.+ U$151.+ U$167.+ U$183.+ U$199.+ U$215.+ U$231.+ U$247.+ 12.63,27.63 13.25,28.25 U$257.P$14
A7
  Top 0.2: U$8.+ U$24.+ U$40.+ U$56.+ U$72.+ U$88.+ U$104.+ U$120.+ U$136.+ U$152.+ U$168.+ U$184.+ U$200.+ U$216.+ U$232.+ U$248.+ 14.18,27.68 14.25,27.75 U$257.P$16
A8
  Top 0.2: U$9.+ U$25.+ U$41.+ U$57.+ U$73.+ U$89.+ U$105.+ U$121.+ U$137.+ U$153.+ U$169.+ U$185.+ U$201.+ U$217.+ U$233.+ U$249.+ 15.72,27.52 15.25,28 U$257.P$18
A9
  Top 0.2: U$10.+ U$26.+ U$42.+ U$58.+ U$74.+ U$90.+ U$106.+ U$122.+ U$138.+ U$154.+ U$170.+ U$186.+ U$202.+ U$218.+ U$234.+ U$250.+ 17.27,27.48 16.25,28.5 U$257.P$20
A10
  Top 0.2: U$11.+ U$27.+ U$43.+ U$59.+ U$75.+ U$91.+ U$107.+ U$123.+ U$139.+ U$155.+ U$171.+ U$187.+ U$203.+ U$219.+ U$235.+ U$251.+ 18.82,27.43 17.25,29 U$257.P$22
A11
  Top 0.2: U$12.+ U$28.+ U$44.+ U$60.+ U$76.+ U$92.+ U$108.+ U$124.+ U$140.+ U$156.+ U$172.+ U$188.+ U$204.+ U$220.+ U$236.+ U$252.+ 20.37,27.38 18.25,29.5 U$257.P$24
A12
  Top 0.2: U$13.+ U$29.+ U$45.+ U$61.+ U$77.+ U$93.+ U$109.+ U$125.+ U$141.+ U$157.+ U$173.+ U$189.+ U$205.+ U$221.+ U$237.+ U$253.+ 21.92,27.33 19.25,30 U$257.P$26
A13
  Top 0.2: U$14.+ U$30.+ U$46.+ U$62.+ U$78.+ U$94.+ U$110.+ U$126.+ U$142.+ U$158.+ U$174.+ U$190.+ U$206.+ U$222.+ U$238.+ U$254.+ 23.47,27.28 20.25,30.5 U$257.P$28
A14
  Top 0.2: U$15.+ U$31.+ U$47.+ U$63.+ U$79.+ U$95.+ U$111.+ U$127.+ U$143.+ U$159.+ U$175.+ U$191.+ U$207.+ U$223.+ U$239.+ U$255.+ 25.02,27.23 21.25,31 U$257.P$30
A15
  Top 0.2: U$16.+ U$32.+ U$48.+ U$64.+ U$80.+ U$96.+ U$112.+ U$128.+ U$144.+ U$160.+ U$176.+ U$192.+ U$208.+ U$224.+ U$240.+ U$256.+ 26.57,27.18 22.25,31.5 U$257.P$32
C0
  Top 0.2: U$257.P$1 6.75,31.5 2.61,27.36 U$241.-
  Bottom 0.203: U$241.- U$242.- U$243.- U$244.- U$245.- U$246.- U$247.- U$248.- U$249.- U$250.- U$251.- U$252.- U$253.- U$254.- U$255.- U$256.-
C1
  Top 0.2: U$257.P$3 7.75,31 4.16,27.41 U$226.-
  Bottom 0.203: U$240.- U$239.- U$238.- U$237.- U$236.- U$235.- U$234.- U$233.- U$232.- U$231.- U$230.- U$229.- U$228.- U$227.- U$226.- U$225.-
C2
  Top 0.2: U$257.P$5 8.75,30.5 5.71,27.46 U$211.-
  Bottom 0.203: U$209.- U$210.- U$211.- U$212.- U$213.- U$214.- U$215.- U$216.- U$217.- U$218.- U$219.- U$220.- U$221.- U$222.- U$223.- U$224.-
C3
  Top 0.2: U$257.P$7 9.75,30 7.26,27.51 U$196.-
  Bottom 0.203: U$208.- U$207.- U$206.- U$205.- U$204.- U$203.- U$202.- U$201.- U$200.- U$199.- U$198.- U$197.- U$196.- U$195.- U$194.- U$193.-
C4
  Top 0.2: U$257.P$9 10.75,29.5 8.81,27.56 U$181.-
  Bottom 0.203: U$177.- U$178.- U$179.- U$180.- U$181.- U$182.- U$183.- U$184.- U$185.- U$186.- U$187.- U$188.- U$189.- U$190.- U$191.- U$192.-
C5
  Top 0.2: U$257.P$11 11.75,29 10.36,27.61 U$166.-
  Bottom 0.203: U$176.- U$175.- U$174.- U$173.- U$172.- U$171.- U$170.- U$169.- U$168.- U$167.- U$166.- U$165.- U$164.- U$163.- U$162.- U$161.-
C6
  Top 0.2: U$257.P$13 12.75,28.5 11.91,27.66 U$151.-
  Bottom 0.203: U$145.- U$146.- U$147.- U$148.- U$149.- U$150.- U$151.- U$152.- U$153.- U$154.- U$155.- U$156.- U$157.- U$158.- U$159.- U$160.-
C7
  Top 0.2: U$257.P$15 13.75,28 13.46,27.71 U$136.-
  Bottom 0.203: U$144.- U$143.- U$142.- U$141.- U$140.- U$139.- U$138.- U$137.- U$136.- U$135.- U$134.- U$133.- U$132.- U$131.- U$130.- U$129.-
C8
  Top 0.2: U$257.P$17 14.75,27.75 15.01,27.49 U$121.-
  Bottom 0.203: U$113.- U$114.- U$115.- U$116.- U$117.- U$118.- U$119.- U$120.- U$121.- U$122.- U$123.- U$124.- U$125.- U$126.- U$127.- U$128.-
C9
  Top 0.2: U$257.P$19 15.75,28.25 16.56,27.44 U$106.-
  Bottom 0.203: U$112.- U$111.- U$110.- U$109.- U$108.- U$107.- U$106.- U$105.- U$104.- U$103.- U$102.- U$101.- U$100.- U$99.- U$98.- U$97.-
C10
  Top 0.2: U$257.P$21 16.75,28.75 18.11,27.39 U$91.-
  Bottom 0.203: U$81.- U$82.- U$83.- U$84.- U$85.- U$86.- U$87.- U$88.- U$89.- U$90.- U$91.- U$92.- U$93.- U$94.- U$95.- U$96.-
C11
  Top 0.2: U$257.P$23 17.75,29.25 19.66,27.34 U$76.-
  Bottom 0.203: U$65.- U$66.- U$67.- U$68.- U$69.- U$70.- U$71.- U$72.- U$73.- U$74.- U$75.- U$76.- U$77.- U$78.- U$79.- U$80.-
C12
  Top 0.2: U$257.P$25 18.75,29.75 21.2,27.3 U$61.-
  Bottom 0.203: U$64.- U$63.- U$62.- U$61.- U$60.- U$59.- U$58.- U$57.- U$56.- U$55.- U$54.- U$53.- U$52.- U$51.- U$50.- U$49.-
C13
  Top 0.2: U$257.P$27 19.75,30.25 22.75,27.25 U$46.-
  Bottom 0.203: U$33.- U$34.- U$35.- U$36.- U$37.- U$38.- U$39.- U$40.- U$41.- U$42.- U$43.- U$44.- U$45.- U$46.- U$47.- U$48.-
C14
  Top 0.2: U$257.P$29 20.75,30.75 24.3,27.2 U$31.-
  Bottom 0.203: U$32.- U$31.- U$30.- U$29.- U$28.- U$27.- U$26.- U$25.- U$24.- U$23.- U$22.- U$21.- U$20.- U$19.- U$18.- U$17.-
C15
  Top 0.2: U$257.P$31 21.75,31.25 25.85,27.15 U$16.-
  Bottom 0.203: U$16.- U$15.- U$14.- U$13.- U$12.- U$11.- U$10.- U$9.- U$8.- U$7.- U$6.- U$5.- U$4.- U$3.- U$2.- U$1.-

### Text on the board
Bottom: Mouth.IO | Warning: | DO NOT INSERT | INTO MOUTH | mouth.io/tongueboard | License: GPL v3 Rev B | Copyright 2013 Zach Hoeken
tPlace: C0 | C1 | C2 | C3 | C4 | C5 | C6 | C7 | C8 | C9 | C10 | C11 | C12 | C13 | C14 | C15 | A0 | A1 | A2 | A3 | A4 | A5 | A6 | A7 | A8 | A9 | A10 | A11 | A12 | A13 | A14 | A15